# EAGLE design BMS Adapter rev3 (EAGLE 9.2.2)
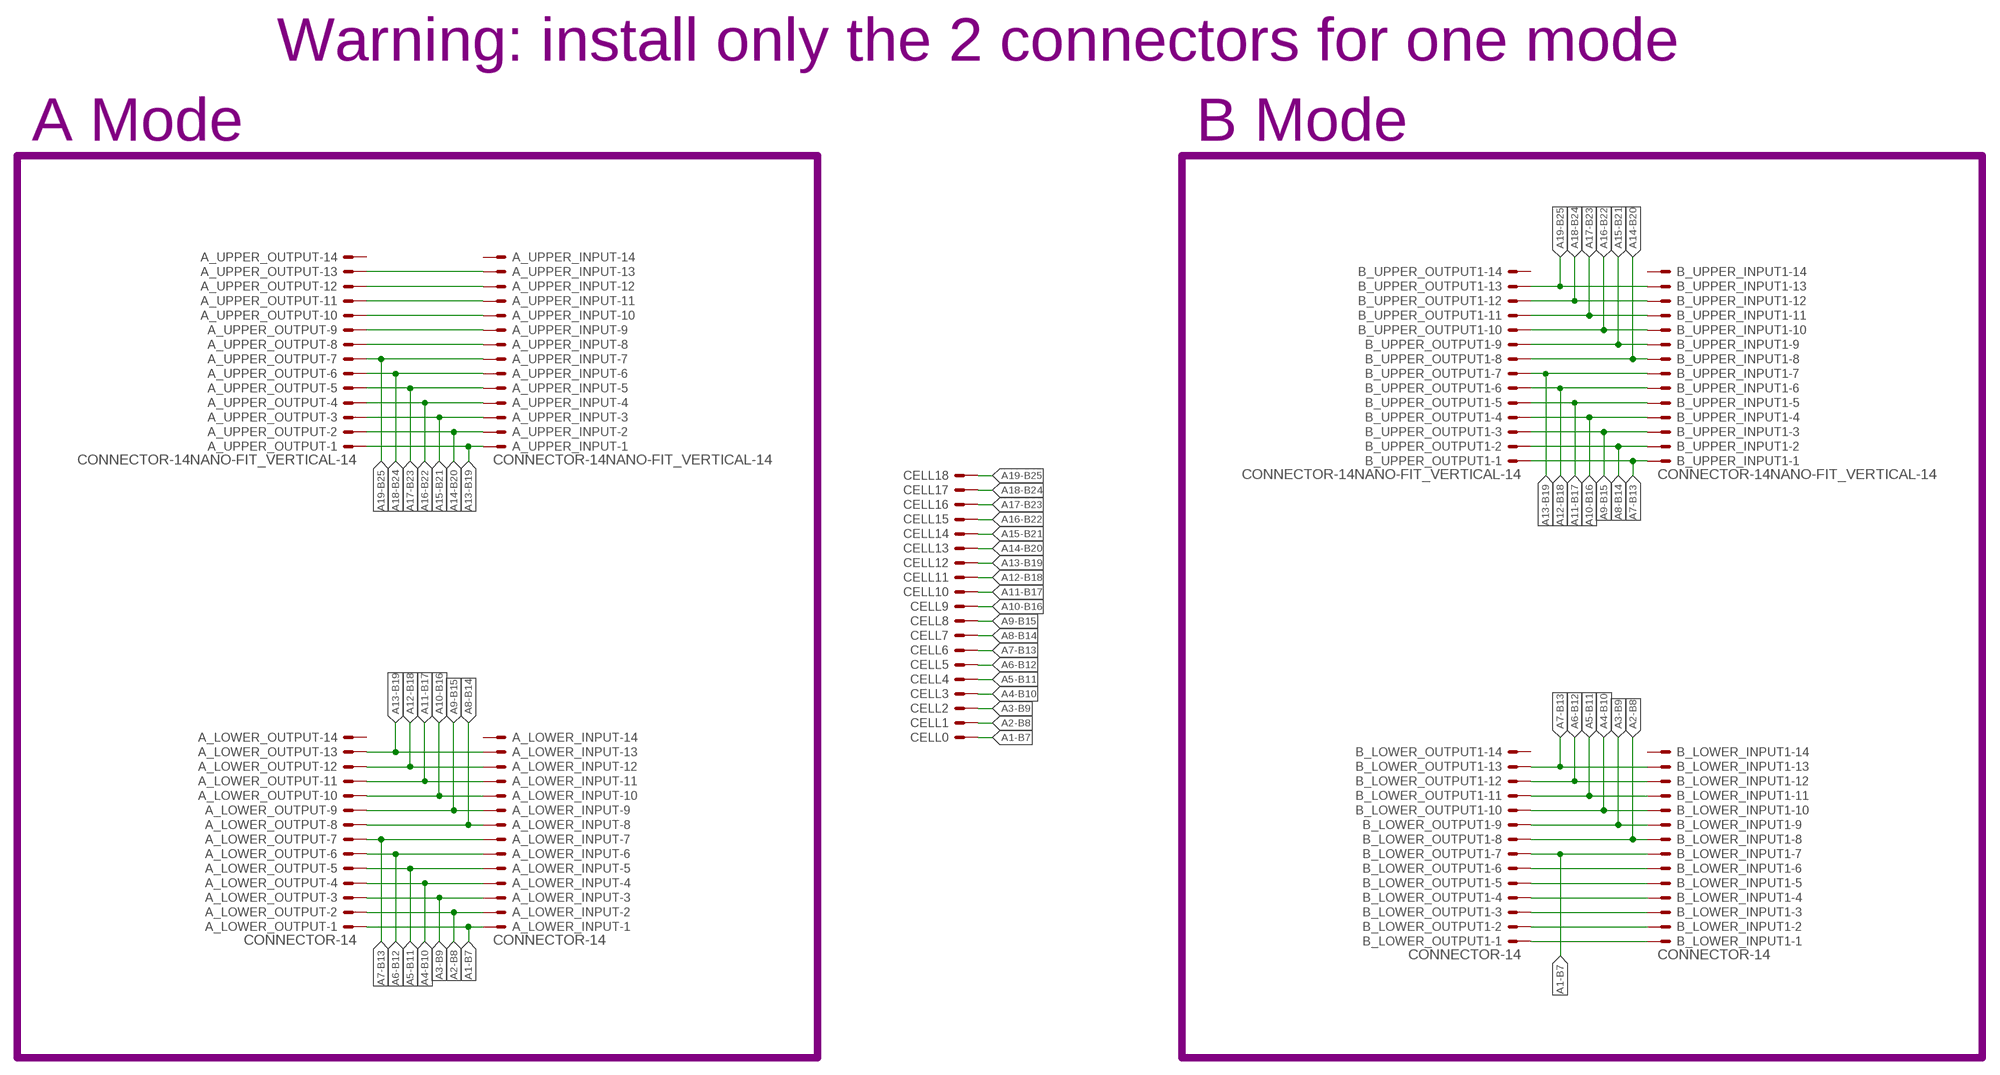
[diagram p0: schematic, sheet 1]

## Parts
A_LOWER_INPUT  CONNECTOR-14  [MINIFIT_5566-14]
A_LOWER_OUTPUT  CONNECTOR-14  [MINIFIT_5566-14]
A_UPPER_INPUT  CONNECTOR-14NANO-FIT_VERTICAL-14  [NANO-FIT_VERTICAL-14]
A_UPPER_OUTPUT  CONNECTOR-14NANO-FIT_VERTICAL-14  [NANO-FIT_VERTICAL-14]
B_LOWER_INPUT1  CONNECTOR-14  [MINIFIT_5566-14]
B_LOWER_OUTPUT1  CONNECTOR-14  [MINIFIT_5566-14]
B_UPPER_INPUT1  CONNECTOR-14NANO-FIT_VERTICAL-14  [NANO-FIT_VERTICAL-14]
B_UPPER_OUTPUT1  CONNECTOR-14NANO-FIT_VERTICAL-14  [NANO-FIT_VERTICAL-14]
CELL0  BATTERY_SPRING_KEYSTONE5222  [KEYSTONE5222]
CELL1  BATTERY_SPRING_KEYSTONE5222  [KEYSTONE5222]
CELL2  BATTERY_SPRING_KEYSTONE5222  [KEYSTONE5222]
CELL3  BATTERY_SPRING_KEYSTONE5222  [KEYSTONE5222]
CELL4  BATTERY_SPRING_KEYSTONE5222  [KEYSTONE5222]
CELL5  BATTERY_SPRING_KEYSTONE5222  [KEYSTONE5222]
CELL6  BATTERY_SPRING_KEYSTONE5222  [KEYSTONE5222]
CELL7  BATTERY_SPRING_KEYSTONE5222  [KEYSTONE5222]
CELL8  BATTERY_SPRING_KEYSTONE5222  [KEYSTONE5222]
CELL9  BATTERY_SPRING_KEYSTONE5222  [KEYSTONE5222]
CELL10  BATTERY_SPRING_KEYSTONE5222  [KEYSTONE5222]
CELL11  BATTERY_SPRING_KEYSTONE5222  [KEYSTONE5222]
CELL12  BATTERY_SPRING_KEYSTONE5222  [KEYSTONE5222]
CELL13  BATTERY_SPRING_KEYSTONE5222  [KEYSTONE5222]
CELL14  BATTERY_SPRING_KEYSTONE5222  [KEYSTONE5222]
CELL15  BATTERY_SPRING_KEYSTONE5222  [KEYSTONE5222]
CELL16  BATTERY_SPRING_KEYSTONE5222  [KEYSTONE5222]
CELL17  BATTERY_SPRING_KEYSTONE5222  [KEYSTONE5222]
CELL18  BATTERY_SPRING_KEYSTONE5222  [KEYSTONE5222]

## Nets
A1-B7: A_LOWER_INPUT.1 A_LOWER_OUTPUT.1 B_LOWER_INPUT1.7 B_LOWER_OUTPUT1.7 CELL0.P$1(S)
A2-B8: A_LOWER_INPUT.2 A_LOWER_OUTPUT.2 B_LOWER_INPUT1.8 B_LOWER_OUTPUT1.8 CELL1.P$1(S)
A3-B9: A_LOWER_INPUT.3 A_LOWER_OUTPUT.3 B_LOWER_INPUT1.9 B_LOWER_OUTPUT1.9 CELL2.P$1(S)
A4-B10: A_LOWER_INPUT.4 A_LOWER_OUTPUT.4 B_LOWER_INPUT1.10 B_LOWER_OUTPUT1.10 CELL3.P$1(S)
A5-B11: A_LOWER_INPUT.5 A_LOWER_OUTPUT.5 B_LOWER_INPUT1.11 B_LOWER_OUTPUT1.11 CELL4.P$1(S)
A6-B12: A_LOWER_INPUT.6 A_LOWER_OUTPUT.6 B_LOWER_INPUT1.12 B_LOWER_OUTPUT1.12 CELL5.P$1(S)
A7-B13: A_LOWER_INPUT.7 A_LOWER_OUTPUT.7 B_LOWER_INPUT1.13 B_LOWER_OUTPUT1.13 B_UPPER_INPUT1.P$1 B_UPPER_OUTPUT1.P$1 CELL6.P$1(S)
A8-B14: A_LOWER_INPUT.8 A_LOWER_OUTPUT.8 B_UPPER_INPUT1.P$2 B_UPPER_OUTPUT1.P$2 CELL7.P$1(S)
A9-B15: A_LOWER_INPUT.9 A_LOWER_OUTPUT.9 B_UPPER_INPUT1.P$3 B_UPPER_OUTPUT1.P$3 CELL8.P$1(S)
A10-B16: A_LOWER_INPUT.10 A_LOWER_OUTPUT.10 B_UPPER_INPUT1.P$4 B_UPPER_OUTPUT1.P$4 CELL9.P$1(S)
A11-B17: A_LOWER_INPUT.11 A_LOWER_OUTPUT.11 B_UPPER_INPUT1.P$5 B_UPPER_OUTPUT1.P$5 CELL10.P$1(S)
A12-B18: A_LOWER_INPUT.12 A_LOWER_OUTPUT.12 B_UPPER_INPUT1.P$6 B_UPPER_OUTPUT1.P$6 CELL11.P$1(S)
A13-B19: A_LOWER_INPUT.13 A_LOWER_OUTPUT.13 A_UPPER_INPUT.P$1 A_UPPER_OUTPUT.P$1 B_UPPER_INPUT1.P$7 B_UPPER_OUTPUT1.P$7 CELL12.P$1(S)
A14-B20: A_UPPER_INPUT.P$2 A_UPPER_OUTPUT.P$2 B_UPPER_INPUT1.P$8 B_UPPER_OUTPUT1.P$8 CELL13.P$1(S)
A15-B21: A_UPPER_INPUT.P$3 A_UPPER_OUTPUT.P$3 B_UPPER_INPUT1.P$9 B_UPPER_OUTPUT1.P$9 CELL14.P$1(S)
A16-B22: A_UPPER_INPUT.P$4 A_UPPER_OUTPUT.P$4 B_UPPER_INPUT1.P$10 B_UPPER_OUTPUT1.P$10 CELL15.P$1(S)
A17-B23: A_UPPER_INPUT.P$5 A_UPPER_OUTPUT.P$5 B_UPPER_INPUT1.P$11 B_UPPER_OUTPUT1.P$11 CELL16.P$1(S)
A18-B24: A_UPPER_INPUT.P$6 A_UPPER_OUTPUT.P$6 B_UPPER_INPUT1.P$12 B_UPPER_OUTPUT1.P$12 CELL17.P$1(S)
A19-B25: A_UPPER_INPUT.P$7 A_UPPER_OUTPUT.P$7 B_UPPER_INPUT1.P$13 B_UPPER_OUTPUT1.P$13 CELL18.P$1(S)
A-PASS1: A_UPPER_INPUT.P$8 A_UPPER_OUTPUT.P$8
A-PASS2: A_UPPER_INPUT.P$9 A_UPPER_OUTPUT.P$9
A-PASS3: A_UPPER_INPUT.P$10 A_UPPER_OUTPUT.P$10
A-PASS4: A_UPPER_INPUT.P$11 A_UPPER_OUTPUT.P$11
A-PASS5: A_UPPER_INPUT.P$12 A_UPPER_OUTPUT.P$12
A-PASS6: A_UPPER_INPUT.P$13 A_UPPER_OUTPUT.P$13
B-PASS1: B_LOWER_INPUT1.1 B_LOWER_OUTPUT1.1
B-PASS2: B_LOWER_INPUT1.2 B_LOWER_OUTPUT1.2
B-PASS3: B_LOWER_INPUT1.3 B_LOWER_OUTPUT1.3
B-PASS4: B_LOWER_INPUT1.4 B_LOWER_OUTPUT1.4
B-PASS5: B_LOWER_INPUT1.5 B_LOWER_OUTPUT1.5
B-PASS6: B_LOWER_INPUT1.6 B_LOWER_OUTPUT1.6
Unconnected: A_LOWER_INPUT.14 A_LOWER_OUTPUT.14 A_UPPER_INPUT.P$14 A_UPPER_OUTPUT.P$14 B_LOWER_INPUT1.14 B_LOWER_OUTPUT1.14 B_UPPER_INPUT1.P$14 B_UPPER_OUTPUT1.P$14

## Notes on the sheet
- Warning: install only the 2 connectors for one mode
- A Mode | B Mode

## Library data of the parts
A_LOWER_INPUT A_LOWER_OUTPUT A_UPPER_INPUT A_UPPER_OUTPUT B_LOWER_INPUT1 B_LOWER_OUTPUT1 B_UPPER_INPUT1 B_UPPER_OUTPUT1 = HyTechDevices:CONNECTOR-14: Mini-Fit Junior connector 14 pole Source: http://www.molex.com
CELL0 CELL1-CELL18 = HyTechDevices:BATTERY_SPRING: Keystone Electronics Battery Spring Contact Datasheet <http://keyelco.com/userAssets/file/M65p17.pdf>

## Module DRAIN+FILTER
Ports: CELL+(in) CELL-(out) S(N)(in) C(N)(out) V-(pwr)
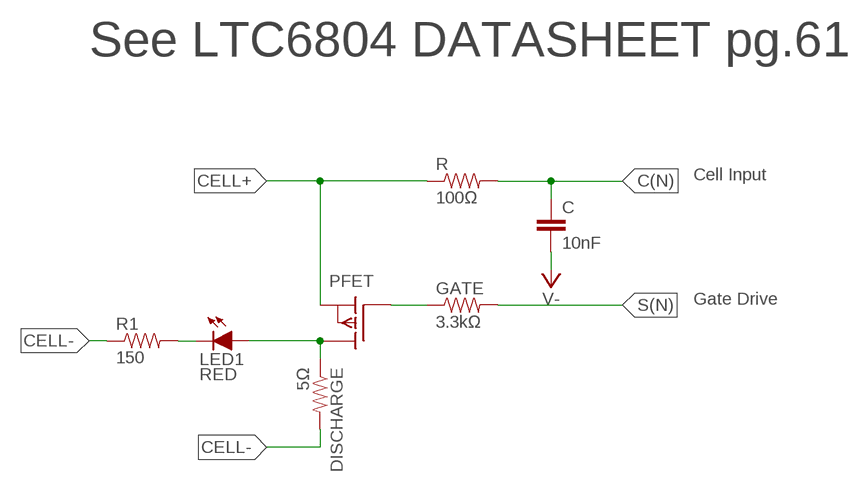
[diagram p1: schematic, module DRAIN+FILTER, sheet 1]

### Parts
C  10nF  CAP0805  [0805]
DISCHARGE  5Ω  RESISTORPWR163  [PWR163]
GATE  3.3kΩ  RESISTOR0805-RES  [0805]
LED1  RED  LED-0805  [LED-805]
PFET  P-CHANNEL_MOSFET_DMP3099L-7  [SOT23]
R  100Ω  RESISTOR0805-RES  [0805]
R1  150  RESISTOR0805-RES  [0805]

### Nets
C(N): C.1 R.2
CELL+: PFET.2(S) R.1
CELL-: DISCHARGE.2 R1.1
GATE: GATE.1 PFET.1(G)
N$1: DISCHARGE.1 LED1.A PFET.3(D)
N$2: LED1.C R1.2
S(N): GATE.2
V-: C.2

### Notes on the sheet
- See LTC6804 DATASHEET pg.61
- Cell Input
- Gate Drive

### Library data of the parts
C = HyTechDevices:CAP: Capacitor Standard 0603 ceramic capacitor, and 0.1" leaded capacitor.
DISCHARGE GATE R R1 = HyTechDevices:RESISTOR: Resistor Basic schematic elements and footprints for 0603, 1206, and PTH resistors.
LED1 = HyTechDevices:LED: Light Emitting Diode (LED) Source: Dangerous Prototypes Eagle Library <https://github.com/DangerousPrototypes/Eagle_Part_Library>
PFET = HyTechDevices:P-CHANNEL_MOSFET_DMP3099L-7: Diodes Incorporated P-Channel Enhancement Mode MOSFET Datasheet <http://www.mouser.com/ds/2/115/DMP3099L-266220.pdf>

## Module THERM_FILTER
Ports: VREF(pwr) GPIO(out) THERM(nc) V-(pwr)
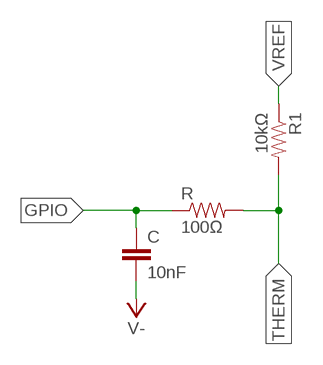
[diagram p2: schematic, module THERM_FILTER, sheet 1]

### Parts
C  10nF  CAP0805  [0805]
R  100Ω  RESISTOR0805-RES  [0805]
R1  10kΩ  RESISTOR0805-RES  [0805]

### Nets
GPIO: C.1 R.1
THERM: R1.2 R.2
V-: C.2
VREF: R1.1

### Library data of the parts
C = HyTechDevices:CAP: Capacitor Standard 0603 ceramic capacitor, and 0.1" leaded capacitor.
R R1 = HyTechDevices:RESISTOR: Resistor Basic schematic elements and footprints for 0603, 1206, and PTH resistors.

## Board
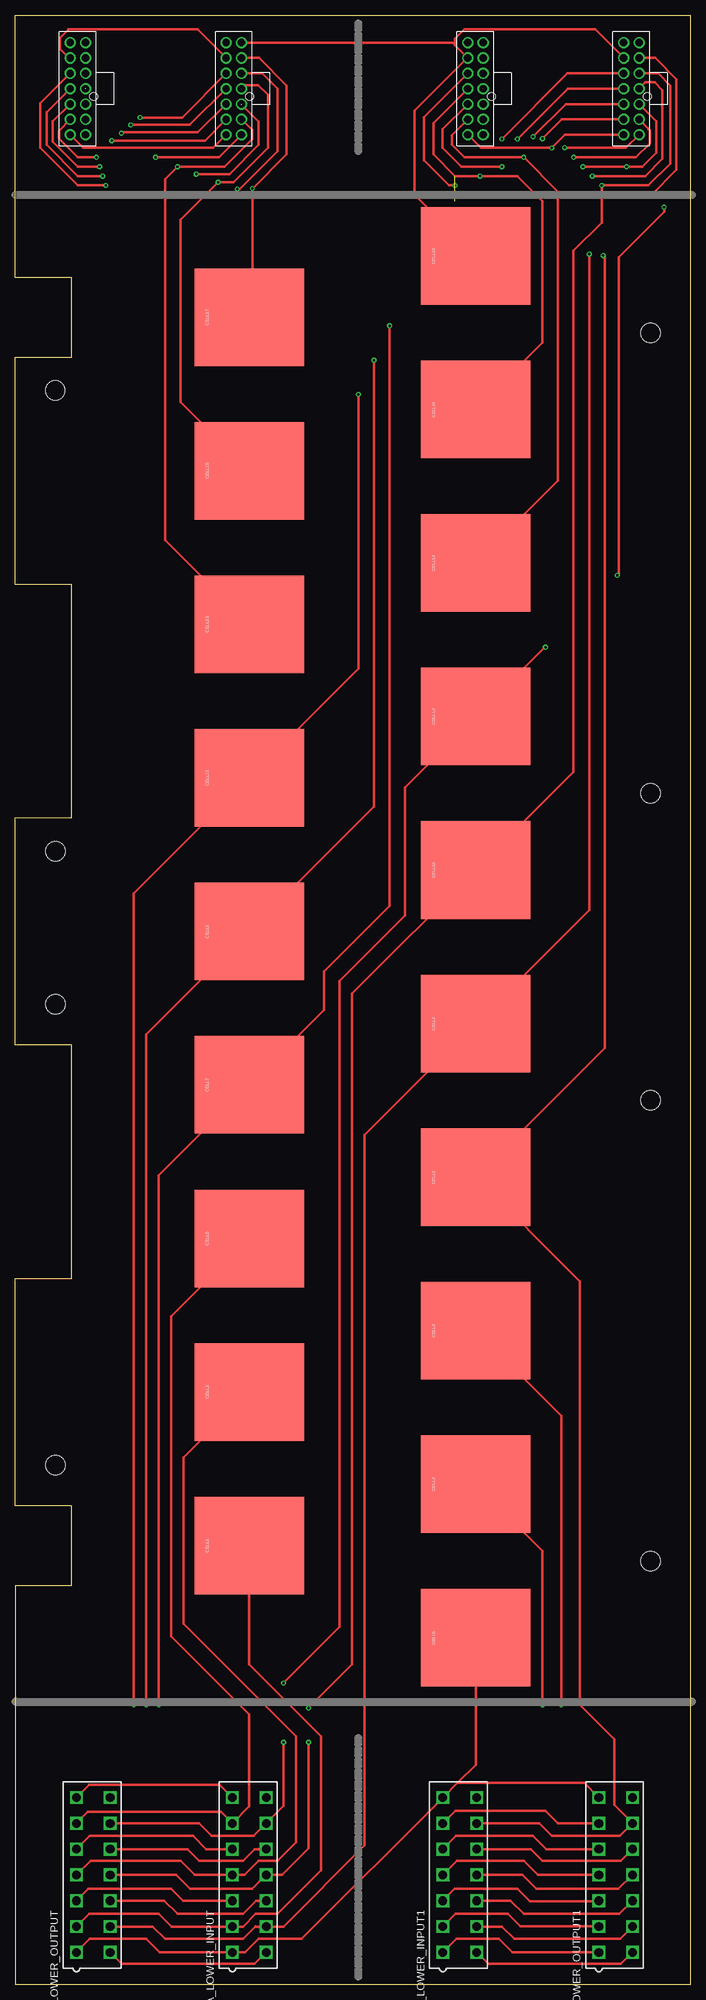
[diagram p3: board, top side]
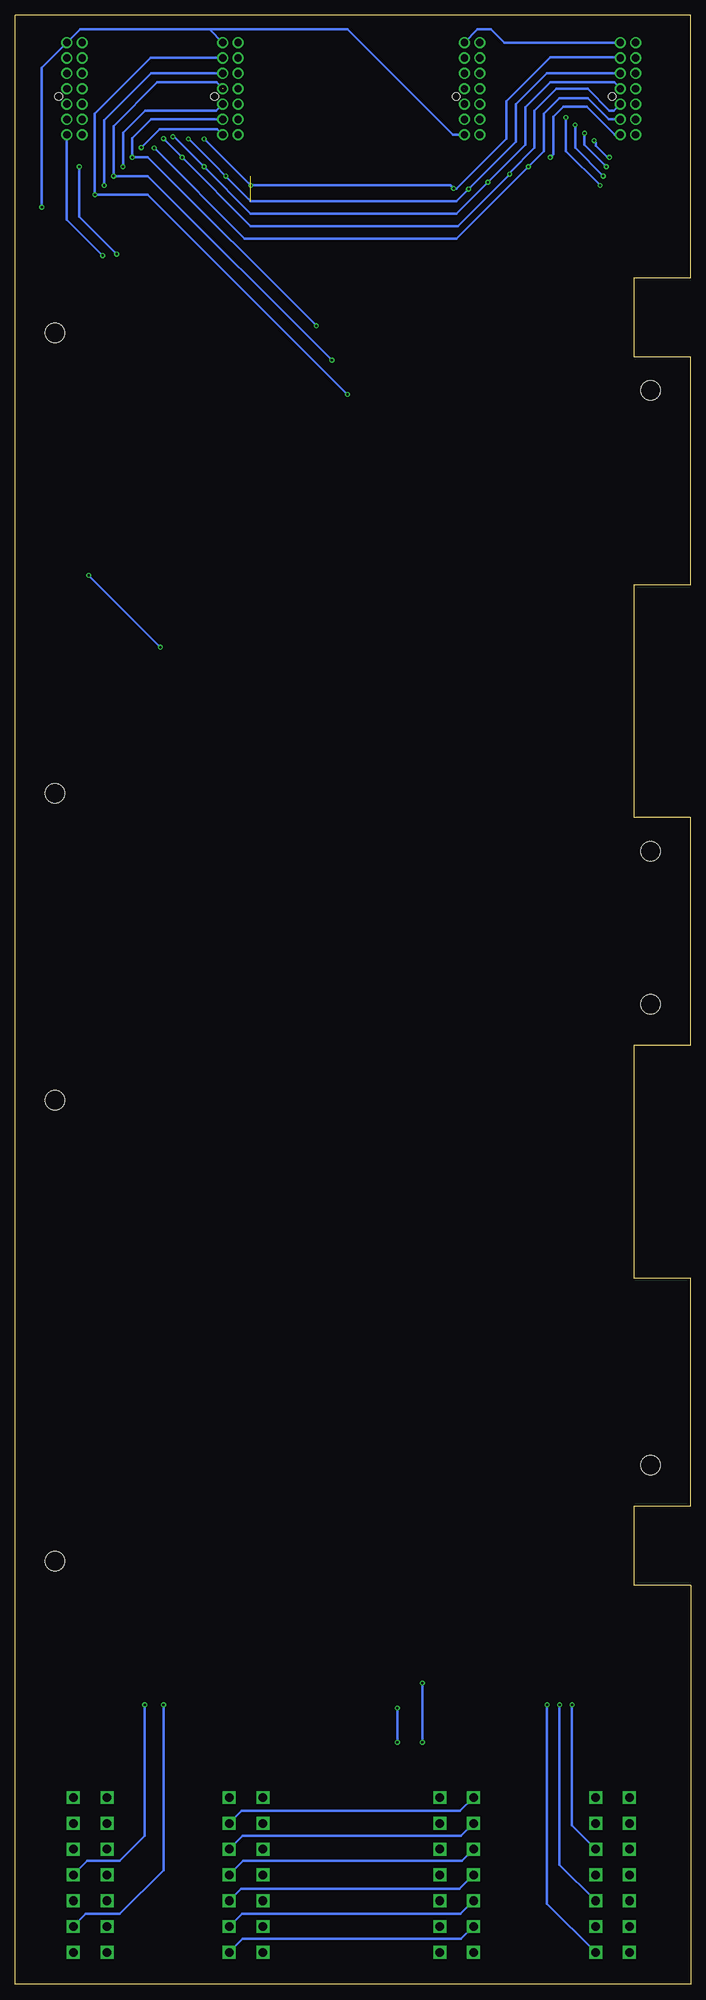
[diagram p4: board, bottom side, seen from below]

Size 109.98 x 320.55 mm. Coordinates in mm from the lower left corner, seen from the top.
Outline: 0,0 109.98,0 109.98,320.55 0,320.55 0,277.88 9.14,277.88 9.14,264.92 0,264.92 0,227.88 9.14,227.88 9.14,189.92 0,189.92 0,152.88 9.14,152.88 9.14,114.92 0,114.92 0,77.88 9.14,77.88 9.14,64.92 0,64.92 0,0
Copper layers (1*16): Top 0.035mm / dielectric 1.5mm / Bottom 0.035mm
Design rules "DRC Advanced Circuits *": minimum track width 6mil, minimum drill 15mil, track to track 24mil, track to pad 24mil, pad to pad 24mil, via to via 24mil, smd to smd 24mil, copper to edge 40mil, drill to drill 6mil, minimum pad ring 10mil, minimum via ring 8mil, stop-mask expansion 4mil, vias tented up to drill 0mil, thermal gap 10mil
Holes 3.2 mm at 6.5,84.52 6.5,159.52 103.5,143.9 103.5,68.9 6.5,184.46 103.5,193.9 6.49,259.52 103.5,268.87

### Footprints (pad centres in the part's own frame; a part is rotated, then mirrored left to right if it is on the bottom)
MINIFIT_5566-14 = drill 1.4 square: 1 12.6,-2.75; 2 8.4,-2.75; 3 4.2,-2.75; 4 0,-2.75; 5 -4.2,-2.75; 6 -8.4,-2.75; 7 -12.6,-2.75; 8 12.6,2.75; 9 8.4,2.75; 10 4.2,2.75; 11 0,2.75; 12 -4.2,2.75; 13 -8.4,2.75; 14 -12.6,2.75
NANO-FIT_VERTICAL-14 = drill 1.2: P$1 -7.5,0; P$2 -5,0; P$3 -2.5,0; P$4 0,0; P$5 2.5,0; P$6 5,0; P$7 7.5,0; P$8 -7.5,2.5; P$9 -5,2.5; P$10 -2.5,2.5; P$11 0,2.5; P$12 2.5,2.5; P$13 5,2.5; P$14 7.5,2.5 | hole 1.3: -1.27,-1.34
KEYSTONE5222 = smd 15.875 x 17.78: P$1 0,0

### Placement (x,y rotation side)
A_LOWER_INPUT  38.1,17.78 270 top
A_LOWER_OUTPUT  12.7,17.78 270 top
A_UPPER_INPUT  36.83,308.61 90 top
A_UPPER_OUTPUT  11.43,308.61 90 top
B_LOWER_INPUT1  72.39,17.78 270 top
B_LOWER_OUTPUT1  97.79,17.78 270 top
B_UPPER_INPUT1  101.6,308.61 90 top
B_UPPER_OUTPUT1  76.2,308.61 90 top
CELL0  75,56.4 270 top
CELL1  38.1,71.4 270 top
CELL2  75,81.4 270 top
CELL3  38.1,96.4 270 top
CELL4  75,106.4 270 top
CELL5  38.1,121.4 270 top
CELL6  75,131.4 270 top
CELL7  38.1,146.4 270 top
CELL8  75,156.4 270 top
CELL9  38.1,171.4 270 top
CELL10  75,181.4 270 top
CELL11  38.1,196.4 270 top
CELL12  75,206.4 270 top
CELL13  38.1,221.4 270 top
CELL14  75,231.4 270 top
CELL15  38.1,246.4 270 top
CELL16  75,256.4 270 top
CELL17  38.1,271.4 270 top
CELL18  75,281.4 270 top

### Tracks (layer width: path | path; a pad name or v marks a point on that pad's centre or on a via)
A1-B7
  Top 0.406: A_LOWER_OUTPUT.1 12.14,7.37 21.34,7.37 23.52,5.18 A_LOWER_INPUT.1 37.44,5.18 39.62,7.37 46.63,7.37 B_LOWER_INPUT1.7 72.03,32.77 | B_LOWER_OUTPUT1.7 92.65,32.77 72.03,32.77 | CELL0.P$1 75,35.74 72.03,32.77
A2-B8
  Top 0.406: A_LOWER_OUTPUT.2 12,11.43 23.37,11.43 25.42,9.38 A_LOWER_INPUT.2 37.07,9.38 39.12,11.43 42.67,11.43 49.78,18.54 49.78,40.39 38.1,52.07 CELL1.P$1 | B_LOWER_INPUT1.8 77.02,3.3 98.66,3.3 B_LOWER_OUTPUT1.8
  Bottom 0.406: B_LOWER_INPUT1.8 72.95,7.37 37.36,7.37 A_LOWER_INPUT.2
A3-B9  (via drill 0.38)
  Top 0.406: A_LOWER_OUTPUT.3 11.86,15.49 25.4,15.49 27.31,13.58 A_LOWER_INPUT.3 | B_LOWER_INPUT1.9 79.27,9.38 81.28,7.37 98.53,7.37 B_LOWER_OUTPUT1.9 | CELL2.P$1 85.85,70.54 v85.85,45.47
  Bottom 0.406: B_LOWER_INPUT1.9 73.09,11.43 37.5,11.43 A_LOWER_INPUT.3 | v85.85,45.47 85.85,18.54 92.96,11.43 98.49,11.43 B_LOWER_OUTPUT1.9
A4-B10
  Top 0.406: A_LOWER_OUTPUT.4 12.24,20.07 26.92,20.07 29.21,17.78 A_LOWER_INPUT.4 37.34,17.78 39.62,20.07 42.67,20.07 45.72,23.11 45.72,40.39 27.43,58.67 27.43,85.73 CELL3.P$1 | B_LOWER_INPUT1.10 80.65,13.58 82.8,11.43 98.39,11.43 B_LOWER_OUTPUT1.10
  Bottom 0.406: B_LOWER_INPUT1.10 73.23,15.49 37.64,15.49 A_LOWER_INPUT.4
A5-B11  (via drill 0.38)
  Top 0.406: A_LOWER_OUTPUT.5 12.1,24.13 28.96,24.13 31.11,21.98 A_LOWER_INPUT.5 | B_LOWER_INPUT1.11 82.55,17.78 84.84,15.49 98.25,15.49 B_LOWER_OUTPUT1.11 | CELL4.P$1 88.9,92.49 v88.9,45.47
  Bottom 0.406: B_LOWER_INPUT1.11 72.85,20.07 37.26,20.07 A_LOWER_INPUT.5 | v88.9,45.47 88.9,24.13 92.96,20.07 98.25,20.07 B_LOWER_OUTPUT1.11
A6-B12
  Top 0.406: A_LOWER_OUTPUT.6 11.81,28.04 33.49,28.04 A_LOWER_INPUT.6 38.1,28.93 38.1,43.94 25.4,56.64 25.4,108.7 CELL5.P$1 | B_LOWER_INPUT1.12 83.94,21.98 85.85,20.07 98.63,20.07 B_LOWER_OUTPUT1.12
  Bottom 0.406: B_LOWER_INPUT1.12 72.99,24.13 37.4,24.13 A_LOWER_INPUT.6
A7-B13  (via drill 0.38)
  Top 0.406: A_LOWER_INPUT.7 33.25,32.48 12.05,32.48 A_LOWER_OUTPUT.7 | B_LOWER_INPUT1.13 85.33,26.18 87.38,24.13 98.49,24.13 B_LOWER_OUTPUT1.13 97.54,29.18 97.54,39.88 91.95,45.47 91.95,114.44 CELL6.P$1 96.01,152.41 96.01,281.18 v95.76,281.43 | B_UPPER_INPUT1.P$1 99.45,298.96 89.53,298.96 | 89.53,298.96 v89.47,299.02 | 89.41,298.84 89.53,298.96
  Bottom 0.406: B_LOWER_INPUT1.13 73.13,28.19 37.54,28.19 A_LOWER_INPUT.7 | B_UPPER_OUTPUT1.P$1 77.1,302.01 86.48,302.01 v89.47,299.02 | v95.76,281.43 101.6,287.27 B_UPPER_INPUT1.P$1
A8-B14  (via drill 0.38)
  Top 0.406: A_LOWER_OUTPUT.8 17.33,3.3 38.97,3.3 A_LOWER_INPUT.8 | v23.37,45.47 23.37,131.67 CELL7.P$1 50.29,158.59 50.29,164.85 60.96,175.51 v60.96,270 | B_UPPER_INPUT1.P$2 103.12,302.09 103.12,302.01 103.31,301.82 103.31,299.65 101.09,297.43 v90.93,297.43
  Bottom 0.406: v23.37,45.47 23.37,13.1 A_LOWER_OUTPUT.8 | B_UPPER_OUTPUT1.P$2 87.88,303.61 90.93,300.56 v90.93,297.43 88.39,297.43 v60.96,270
A9-B15  (via drill 0.38)
  Top 0.406: A_LOWER_OUTPUT.9 22.35,9.38 24.37,7.37 37.08,7.37 39.12,9.4 39.13,9.38 A_LOWER_INPUT.9 43.67,9.38 56.9,22.61 56.9,138.3 CELL8.P$1 93.47,174.87 v93.47,281.69 | B_UPPER_INPUT1.P$3 104.39,303.32 104.39,298.2 102.11,295.91 v99.57,295.91 v92.46,295.91
  Bottom 0.406: v92.46,295.91 92.46,301.46 88.87,305.05 77.26,305.05 B_UPPER_OUTPUT1.P$3 | v93.47,281.69 99.57,287.78 v99.57,295.91
A10-B16  (via drill 0.38)  (1 unrouted)
  Top 0.406: A_LOWER_OUTPUT.10 24.27,13.58 26.42,11.43 37.08,11.43 39.23,13.58 A_LOWER_INPUT.10 | v21.34,45.47 21.34,154.64 CELL9.P$1 58.42,191.72 v58.42,264.41 | B_UPPER_INPUT1.P$4 102.62,309.63 104.14,309.63 105.41,308.36 105.41,297.18 102.62,294.39 v93.98,294.39
  Bottom 0.406: v21.34,45.47 21.34,19.47 A_LOWER_OUTPUT.10 | 76.18,308.63 77.18,309.63 86.87,309.63 93.98,302.51 v93.98,294.39 88.39,294.39 v58.42,264.41
A11-B17  (via drill 0.38)
  Top 0.406: A_LOWER_OUTPUT.11 26.16,17.78 28.45,15.49 38.56,15.49 A_LOWER_INPUT.11 43.43,17.78 47.75,22.1 v47.75,39.37 | v47.75,44.96 54.86,52.07 54.86,161.26 CELL10.P$1 90.93,197.33 90.93,282.19 95.5,286.77 v95.5,292.86 103.12,292.86 106.68,296.42 106.68,309.12 104.69,311.11 B_UPPER_INPUT1.P$5
  Bottom 0.406: v47.75,39.37 v47.75,44.96 | B_UPPER_OUTPUT1.P$5 87.88,311.11 95.5,303.49 v95.5,292.86
A12-B18  (via drill 0.38)
  Top 0.406: A_LOWER_OUTPUT.12 28.06,21.98 29.97,20.07 37.08,20.07 39,21.98 A_LOWER_INPUT.12 | v19.3,45.47 19.3,177.6 CELL11.P$1 55.88,214.18 v55.88,258.83 | B_UPPER_INPUT1.P$6 104.22,313.61 107.7,310.13 107.7,295.4 103.63,291.34 v97.03,291.34
  Bottom 0.406: v19.3,45.47 19.3,25.83 A_LOWER_OUTPUT.12 | B_UPPER_OUTPUT1.P$6 87.96,313.61 97.03,304.55 v97.03,291.34 88.39,291.34 v55.88,258.83
A13-B19  (via drill 0.38)
  Top 0.406: A_LOWER_OUTPUT.13 29.95,26.18 32,24.13 38.8,24.13 A_LOWER_INPUT.13 43.69,29.02 v43.69,39.37 | v43.69,49.02 52.83,58.17 52.83,163.32 63.46,173.95 63.46,194.86 CELL12.P$1 86.28,217.68 v86.36,217.68 | v22.86,297.43 33.15,297.43 A_UPPER_INPUT.P$1 | v98.04,229.36 98.3,229.62 98.3,281.18 105.66,288.54 v105.66,289.31
  Bottom 0.406: v43.69,39.37 v43.69,49.02 | A_UPPER_OUTPUT.P$1 12.31,301.11 16.89,305.69 20.7,305.69 22.35,304.04 22.35,297.94 v22.86,297.43 | 78.35,318.26 B_UPPER_OUTPUT1.P$7 | 78.35,318.26 99.45,318.26 B_UPPER_INPUT1.P$7 105.66,312.05 v105.66,289.31 | 78.35,318.26 55.88,318.26 38.73,301.11 A_UPPER_INPUT.P$1 | v86.36,217.68 v98.04,229.36
A14-B20  (via drill 0.38)
  Top 0.406: A_UPPER_INPUT.P$2 38.54,301.9 38.54,300.4 34.05,295.91 v26.42,295.91 24.38,293.88 24.38,235.12 CELL13.P$1 | B_UPPER_OUTPUT1.P$8 75.85,298.96 v87.38,298.96 89.53,301.11 B_UPPER_INPUT1.P$8
  Bottom 0.406: A_UPPER_OUTPUT.P$2 13.29,303.61 16.76,307.09 21.34,307.09 23.88,304.55 23.88,298.45 v26.42,295.91 38.1,284.23 72.64,284.23 v87.38,298.96
A15-B21  (via drill 0.38)  (1 unrouted)
  Top 0.406: v29.46,294.7 34.86,294.7 39.62,299.47 39.62,303.24 36.79,306.07 | B_UPPER_OUTPUT1.P$9 71.12,301.03 71.12,299.47 73.15,297.43 v82.8,297.43 88.39,291.85 88.39,244.79 CELL14.P$1 | v85.85,300.48 88.98,303.61 B_UPPER_INPUT1.P$9
  Bottom 0.406: A_UPPER_OUTPUT.P$3 12.49,305.05 13.21,305.05 16.76,308.61 21.84,308.61 25.4,305.05 25.4,298.96 29.46,294.89 v29.46,294.7 37.91,286.26 71.63,286.26 v82.8,297.43 v85.85,300.48
A16-B22  (via drill 0.38)  (2 unrouted)
  Top 0.406: 36.81,308.63 37.4,309.21 39.53,309.21 41.15,307.59 41.15,298.96 35.56,293.37 v33.02,293.37 26.92,287.27 26.92,257.58 CELL15.P$1 | B_UPPER_OUTPUT1.P$10 69.6,302.01 69.6,298.96 72.64,295.91 v79.25,295.91 | v84.33,300.8 89.64,306.11 B_UPPER_INPUT1.P$10
  Bottom 0.406: A_UPPER_OUTPUT.P$4 11.81,308.99 | 11.41,308.63 12.41,309.63 22.86,309.63 26.92,305.56 26.92,299.47 v33.02,293.37 38.1,288.29 71.63,288.29 v79.25,295.91 84.14,300.8 v84.33,300.8
A17-B23  (via drill 0.38)  (1 unrouted)
  Top 0.406: v36.16,292.26 36.48,292.26 42.67,298.45 42.67,308.61 40.17,311.11 A_UPPER_INPUT.P$5 | B_UPPER_OUTPUT1.P$11 68.07,302.98 68.07,297.94 71.63,294.39 v75.69,294.39 81.79,294.39 85.85,290.32 85.85,267.25 CELL16.P$1 | v81.79,300.41 89.99,308.61 B_UPPER_INPUT1.P$11
  Bottom 0.406: A_UPPER_OUTPUT.P$5 11.47,311.15 23.37,311.15 28.45,306.07 28.45,299.97 v36.16,292.26 38.1,290.32 71.63,290.32 81.72,300.41 v81.79,300.41
A18-B24  (via drill 0.38)
  Top 0.406: A_UPPER_INPUT.P$6 39.7,313.61 44.2,309.12 44.2,297.94 v38.61,292.35 38.61,271.91 CELL17.P$1 | B_UPPER_OUTPUT1.P$12 66.55,303.96 66.55,296.93 70.61,292.86 v71.63,292.86 | v79.25,300.41 89.95,311.11 B_UPPER_INPUT1.P$12
  Bottom 0.406: A_UPPER_OUTPUT.P$6 11.51,313.69 22.86,313.69 29.97,306.58 29.97,300.48 38.1,292.35 v38.61,292.35 39.12,292.86 v71.63,292.86 79.18,300.41 v79.25,300.41
A19-B25
  Top 0.406: B_UPPER_OUTPUT1.P$13 73.64,313.67 | 73.64,313.67 71.63,315.68 | 71.63,315.68 71.63,316.74 73.15,318.26 94.45,318.26 B_UPPER_INPUT1.P$13 | A_UPPER_INPUT.P$7 71.2,316.11 71.63,315.68 | CELL18.P$1 65.02,291.37 65.02,305.05 73.64,313.67
  Bottom 0.406: A_UPPER_INPUT.P$7 34.68,318.26 32.51,318.26 30.36,316.11 A_UPPER_OUTPUT.P$7
A-PASS1
  Top 0.406: A_UPPER_INPUT.P$8 32.18,298.96 11.08,298.96 A_UPPER_OUTPUT.P$8
A-PASS2  (via drill 0.38)
  Top 0.406: A_UPPER_OUTPUT.P$9 7.11,301.79 7.11,300.48 10.16,297.43 v13.21,297.43 | A_UPPER_INPUT.P$9 30.88,300.16 v15.72,300.16
  Bottom 0.406: v13.21,297.43 13.53,297.43 15.4,299.31 15.4,299.85 v15.72,300.16
A-PASS3  (via drill 0.38)
  Top 0.406: A_UPPER_OUTPUT.P$10 6.1,303.28 6.1,299.97 10.16,295.91 v13.72,295.91 | A_UPPER_INPUT.P$10 29.72,301.5 17.4,301.5 v17.27,301.37
  Bottom 0.406: v13.72,295.91 17.27,299.47 v17.27,301.37
A-PASS4  (via drill 0.38)
  Top 0.406: A_UPPER_OUTPUT.P$11 5.08,304.76 5.08,299.47 10.16,294.39 v14.22,294.39 | A_UPPER_INPUT.P$11 28.42,302.7 v18.8,302.7
  Bottom 0.406: v18.8,302.7 18.8,298.96 v14.22,294.39
A-PASS5  (via drill 0.38)
  Top 0.406: A_UPPER_OUTPUT.P$12 4.06,306.24 4.06,298.96 10.16,292.86 v14.73,292.86 | A_UPPER_INPUT.P$12 27.13,303.91 v20.32,303.91
  Bottom 0.406: v14.73,292.86 20.32,298.45 v20.32,303.91
A-PASS6
  Top 0.406: A_UPPER_OUTPUT.P$13 8.82,313.5 7.22,315.11 7.22,316.82 8.64,318.24 8.64,318.26 29.68,318.26 A_UPPER_INPUT.P$13
B-PASS1
  Top 0.406: B_LOWER_INPUT1.1 71.83,7.37 78.74,7.37 80.93,5.18 B_LOWER_OUTPUT1.1
B-PASS2
  Top 0.406: B_LOWER_INPUT1.2 71.69,11.43 80.26,11.43 82.3,9.4 95.02,9.4 B_LOWER_OUTPUT1.2
B-PASS3
  Top 0.406: B_LOWER_INPUT1.3 71.55,15.49 81.79,15.49 83.82,13.46 94.92,13.46 B_LOWER_OUTPUT1.3
B-PASS4
  Top 0.406: B_LOWER_INPUT1.4 71.93,20.07 82.8,20.07 85.09,17.78 B_LOWER_OUTPUT1.4
B-PASS5
  Top 0.406: B_LOWER_INPUT1.5 71.79,24.13 84.33,24.13 86.48,21.98 B_LOWER_OUTPUT1.5
B-PASS6
  Top 0.406: B_LOWER_INPUT1.6 71.65,28.19 86.36,28.19 88.39,26.16 95.02,26.16 B_LOWER_OUTPUT1.6

### Text on the board
tDocu: Mode A | Mode B | Out | In | Out | In | DANGER HIGH VOLTAGE | DANGER HIGH VOLTAGE | DANGER HIGH VOLTAGE | BMS Enerdel Adapter 2019 rev3 | Warning: Only install Mode A or Mode B connectors, do not mix | Mode A | Mode B | Out | In | Out | In